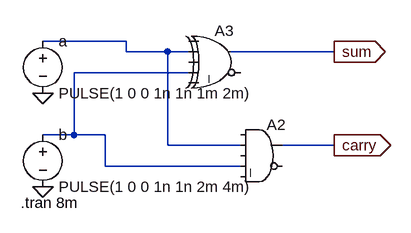
[diagram p0: schematic HALF ADDER.asc]
HALF ADDER.asc, the LTspice schematic file:
Version 4
SHEET 1 880 680
WIRE -16 80 -144 80
WIRE -16 96 -16 80
WIRE 48 96 -16 96
WIRE 80 96 48 96
WIRE 304 96 144 96
WIRE 80 128 -96 128
WIRE -96 224 -96 128
WIRE -96 224 -144 224
WIRE -48 224 -96 224
WIRE 48 240 48 96
WIRE 160 240 48 240
WIRE 304 240 224 240
WIRE -48 272 -48 224
WIRE 160 272 -48 272
FLAG -144 160 0
FLAG -144 304 0
FLAG 304 96 sum
IOPIN 304 96 Out
FLAG 304 240 carry
IOPIN 304 240 Out
SYMBOL Digital\\and 192 192 R0
SYMATTR InstName A2
SYMBOL Digital\\xor 128 48 R0
SYMATTR InstName A3
SYMBOL voltage -144 64 R0
WINDOW 123 0 0 Left 0
WINDOW 39 0 0 Left 0
SYMATTR InstName a
SYMATTR Value PULSE(1 0 0 1n 1n 1m 2m)
SYMBOL voltage -144 208 R0
WINDOW 123 0 0 Left 0
WINDOW 39 0 0 Left 0
SYMATTR InstName b
SYMATTR Value PULSE(1 0 0 1n 1n 2m 4m)
TEXT -178 328 Left 2 !.tran 8m

The netlist it stands for:
* HALF ADDER.asc
A2 0 N001 0 N002 0 0 carry 0 AND
A3 0 N001 0 N002 0 0 sum 0 XOR
V§a N001 0 PULSE(1 0 0 1n 1n 1m 2m)
V§b N002 0 PULSE(1 0 0 1n 1n 2m 4m)
.tran 8m
.backanno
.end